# Altium schematic sheet Sheet1.SchDoc
size A4
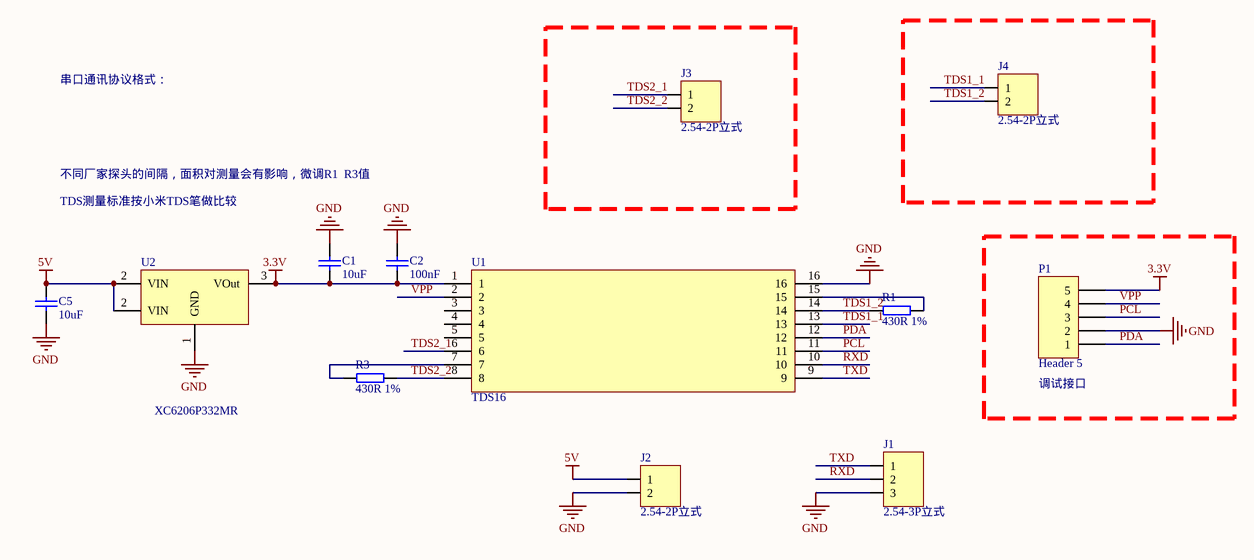
[diagram p0: Sheet1.SchDoc]

## Parts
C1  10uF  [LC-0603_C]
C2  100nF  [LC-0603_C]
C5  10uF  [LC-0603_C]
J1  2.54-3P立式  [3P2.54]
J2  2.54-2P立式  [2P2.54]
J3  2.54-2P立式  [2P2.54]
J4  2.54-2P立式  [2P2.54]
P1  Header 5  [HDR1X5]
R1  430R 1%  [LC-0603_R]
R3  430R 1%  [LC-0603_R]
U1  TDS16  [LC-SOIC-16_150mil]
U2  XC6206P332MR  [LC-SOT-23(SOT-23-3)]

## Nets
3.3V: C1.1 C2.1 P1.5 U1.1 U2.3(VOut)
5V: C5.2 J2.1 U2.2(VIN)
GND: C1.2 C2.2 C5.1 J1.3 J2.2 P1.2 U1.16 U2.1(GND)
PCL: P1.3 U1.11
PDA: P1.1 U1.12
RXD: J1.2 U1.10
TDS1_1: J4.1 U1.13
TDS1_2: J4.2 R1.2 U1.14
TDS2_1: J3.1 U1.6
TDS2_2: J3.2 R3.1 U1.8
TXD: J1.1 U1.9
VPP: P1.4 U1.2
NetR1_1: R1.1 U1.15
NetR3_2: R3.2 U1.7

Not connected (* = marked no-connect by the designer): U1 3 4 5

## Notes on the sheet
- 串口通讯协议格式：
- TDS测量标准按小米TDS笔做比较
- 不同厂家探头的间隔，面积对测量会有影响，微调R1  R3值
- (near P1) 调试接口

## Library data of the parts
C1 C2 C5 = C0603
P1 = Header 5: Header, 5-Pin; LatestRevisionDate: 17-Jul-2002; LatestRevisionNote: Re-released for DXP Platform.; Publisher: Altium Limited
R1 R3 = R0603
U2 = HT75XX_SOT89